# EAGLE design RelayWingTesterRevB (EAGLE 9.2.2)
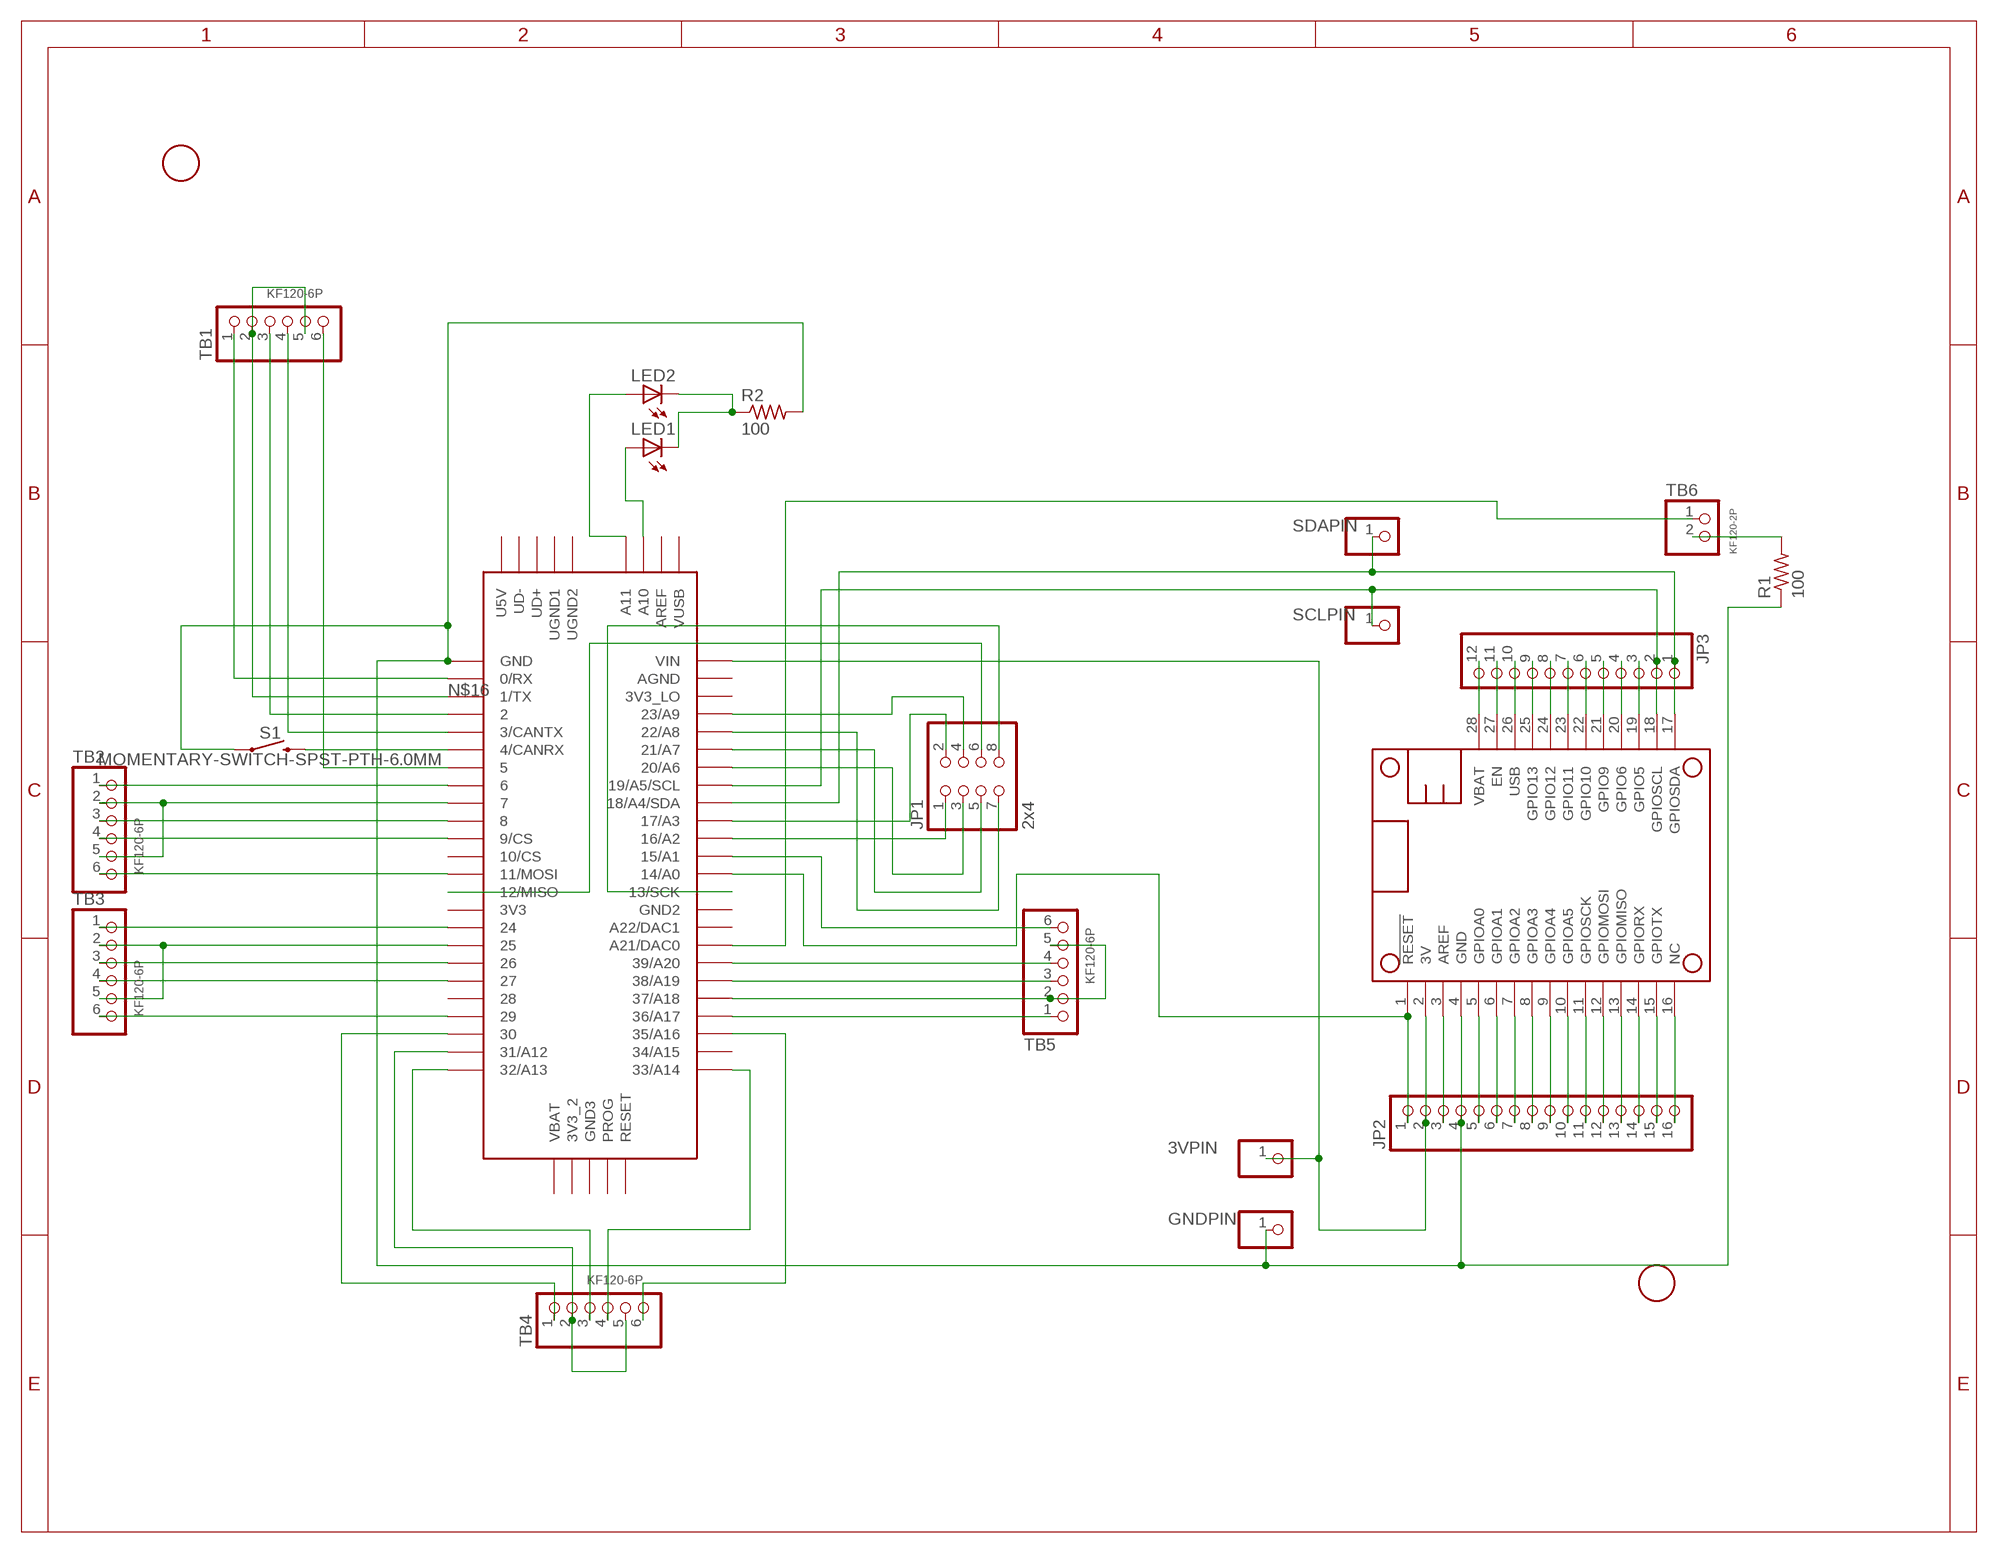
[diagram p0: schematic, sheet 1]

## Parts
3VPIN  PINHD-1X1  [1X01]
GNDPIN  PINHD-1X1  [1X01]
JP1  2x4  PINHD-2X4  [2X04]
JP2  PINHD-1X16  [1X16]
JP3  PINHD-1X12  [1X12]
LED1  LED5MM  [LED5MM]
LED2  LED5MM  [LED5MM]
MS1  FEATHERWING_NODIM  [FEATHERWING_DIM]
R1  100  R-US_0207/10  [0207/10]
R2  100  R-US_0207/10  [0207/10]
S1  MOMENTARY-SWITCH-SPST-PTH-6.0MM  [TACTILE_SWITCH_PTH_6.0MM]
SCLPIN  PINHD-1X1  [1X01]
SDAPIN  PINHD-1X1  [1X01]
TB1  KF120-6P  [KF120-6P_ROUND]
TB2  KF120-6P  [KF120-6P_ROUND]
TB3  KF120-6P  [KF120-6P_ROUND]
TB4  KF120-6P  [KF120-6P_ROUND]
TB5  KF120-6P  [KF120-6P_ROUND]
TB6  KF120-2P  [KF120-2P_ROUND]
U$2  FIDUCIAL  [FIDUCIAL_1MM]
U$3  FIDUCIAL  [FIDUCIAL_1MM]
U$4  TEENSY_3.5/3.6  [TEENSY_3.5/3.6]

## Nets
3V: 3VPIN.1 JP2.2 MS1.2(3V) U$4.VIN
GND: GNDPIN.1 JP2.4 MS1.4(GND) R1.1 R2.2 S1.1 U$4.GND
N$1: JP2.3 MS1.3(AREF)
N$2: JP3.1 MS1.17(GPIOSDA) SDAPIN.1 U$4.18/A4/SDA
N$3: JP2.5 MS1.5(GPIOA0)
N$4: JP2.6 MS1.6(GPIOA1)
N$5: JP2.7 MS1.7(GPIOA2)
N$6: JP2.8 MS1.8(GPIOA3)
N$7: JP2.9 MS1.9(GPIOA4)
N$8: JP2.10 MS1.10(GPIOA5)
N$9: JP2.11 MS1.11(GPIOSCK)
N$10: JP2.12 MS1.12(GPIOMOSI)
N$11: JP2.13 MS1.13(GPIOMISO)
N$12: JP2.14 MS1.14(GPIORX)
N$13: JP2.15 MS1.15(GPIOTX)
N$14: JP2.16 MS1.16(NC)
N$15: JP3.3 MS1.19(GPIO5)
N$16: TB1.1 U$4.0/RX
N$17: TB1.2 TB1.5 U$4.1/TX
N$18: R1.2 TB6.2
N$19: JP3.4 MS1.20(GPIO6)
N$20: JP3.5 MS1.21(GPIO9)
N$21: JP3.6 MS1.22(GPIO10)
N$22: JP3.7 MS1.23(GPIO11)
N$23: JP3.8 MS1.24(GPIO12)
N$24: TB1.3 U$4.2
N$25: TB1.4 U$4.3/CANTX
N$26: S1.3 U$4.4/CANRX
N$27: TB1.6 U$4.5
N$28: TB2.1 U$4.6
N$29: TB2.2 TB2.5 U$4.7
N$30: TB2.3 U$4.8
N$31: TB2.4 U$4.9/CS
N$33: TB2.6 U$4.11/MOSI
N$34: TB3.1 U$4.24
N$35: TB3.2 TB3.5 U$4.25
N$36: TB3.3 U$4.26
N$37: TB3.4 U$4.27
N$39: TB3.6 U$4.29
N$40: TB4.1 U$4.30
N$41: TB4.2 TB4.5 U$4.31/A12
N$42: TB4.3 U$4.32/A13
N$43: TB4.4 U$4.33/A14
N$45: TB4.6 U$4.35/A16
N$46: TB5.1 U$4.36/A17
N$47: TB5.2 TB5.5 U$4.37/A18
N$48: TB5.3 U$4.38/A19
N$49: TB5.4 U$4.39/A20
N$51: JP3.9 MS1.25(GPIO13)
N$52: TB5.6 U$4.15/A1
N$53: TB6.1 U$4.21/DAC0(A21/DAC0)
N$55: JP1.1 U$4.16/A2
N$56: JP1.2 U$4.17/A3
N$57: JP1.3 U$4.20/A6
N$58: JP1.5 U$4.21/A7
N$59: JP1.7 U$4.22/A8
N$60: JP1.4 U$4.23/A9
N$61: JP3.11 MS1.27(EN)
N$62: JP1.6 U$4.12/MISO
N$63: JP1.8 U$4.13/SCK
N$64: LED2.A U$4.A11
N$65: LED1.A U$4.A10
N$66: LED1.K(C) LED2.K(C) R2.1
RESET: JP2.1 MS1.1(!RESET) U$4.14/A0
SCL: JP3.2 MS1.18(GPIOSCL) SCLPIN.1 U$4.19/A5/SCL
USB: JP3.10 MS1.26(USB)
VBAT: JP3.12 MS1.28(VBAT)
Unconnected: U$4.3V3 U$4.3V3_2 U$4.3V3_LO U$4.10/CS U$4.28 U$4.34/A15 U$4.A22/DAC1 U$4.AGND U$4.AREF U$4.GND2 U$4.GND3 U$4.PROG U$4.RESET U$4.U5V U$4.UD+ U$4.UD- U$4.UGND1 U$4.UGND2 U$4.VBAT U$4.VUSB

## Library data of the parts
3VPIN GNDPIN SCLPIN SDAPIN = adafruit:PINHD-1X1: Pin header 1x1 for 0.1" spacing With round pins
JP1 = pinhead:PINHD-2X4: PIN HEADER
JP2 = pinhead:PINHD-1X16: PIN HEADER
JP3 = pinhead:PINHD-1X12: PIN HEADER
LED1 LED2 = adafruit:LED: LED OSRAM: - CHIPLED LG R971, LG N971, LY N971, LG Q971, LY Q971, LO R971, LY R971 LH N974, LH R974 LS Q976, LO Q976, LY Q976 LO Q996 - Hyper CHIPLED LW Q18S LB Q993, LB Q99A, LB R99A - SideLED LS A670, LO A670, LY A670, LG A670, LP A670 LB A673, LV A673, LT A673, LW A673 LH A674 LY A675 LS A676, LA A676, LO A676, LY A676, LW A676 LS A679, LY A679, LG A679 - Hyper Micro SIDELED® LS Y876, LA Y876, LO Y876, LY Y876 LT Y87S - SmartLED LW L88C, LW L88S LB L89C, LB L89S, LG L890 LS L89K, LO L89K, LY L89K LS L896, LA L896, LO L896, LY L896 - TOPLED LS T670, LO T670, LY T670, LG T670, LP T670 LSG T670, LSP T670, LSY T670, LOP T670, LYG T670 LG T671, LOG T671, LSG T671 LB T673, LV T673, LT T673, LW T673 LH T674 LS T676, LA T676, LO T676, LY T676, LB T676, LH T676, LSB T676, LW T676 LB T67C, LV T67C, LT T67C, LS T67K, LO T67K, LY T67K, LW E67C LS E67B, LA E67B, LO E67B, LY E67B, LB E67C, LV E67C, LT E67C LW T67C LS T679, LY T679, LG T679 LS T770, LO T770, LY T770, LG T770, LP T770 LB T773, LV T773, LT T773, LW T773 LH T774 LS E675, LA E675, LY E675, LS T675 LS T776, LA T776, LO T776, LY T776, LB T776 LHGB T686 LT T68C, LB T68C - Hyper Mini TOPLED® LB M676 - Mini TOPLED Santana® LG M470 LS M47K, LO M47K, LY M47K Source: http://www.osram.convergy.de/
MS1 = microbuilder:FEATHERWING
R1 = resistor:R-US_: RESISTOR, American symbol
R2 = adafruit:R-US_: RESISTOR, American symbol
S1 = SparkFun-Switches:MOMENTARY-SWITCH-SPST: Momentary Switch (Pushbutton) - SPST Normally-open (NO) SPST momentary switches (buttons, pushbuttons). Variants PTH-12MM - 12mm square, through-hole Momentary Pushbutton Switch - 12mm Square <https://www.sparkfun.com/products/9190> (COM-09190) PTH-6.0MM, PTH-6.0MM-KIT - 6.0mm square, through-hole Mini Pushbutton Switch <https://www.sparkfun.com/products/97> (COM-00097) KIT package intended for soldering kit's - only one side of pads' copper is exposed. PTH-RIGHT-ANGLE-KIT - Right-angle, through-hole Right Angle Tactile Button <https://www.sparkfun.com/products/10791> - Used on SparkFun BigTime Watch Kit <https://www.sparkfun.com/products/11734> SMD-12MM - 12mm square, surface-mount Tactile Button - SMD (12mm) <https://www.sparkfun.com/products/12993> (COM-12993) Used on SparkFun PicoBoard <https://www.sparkfun.com/products/11888> SMD-4.5MM - 4.5mm Square Trackball Switch Used on SparkFun Blackberry Trackballer Breakout <https://www.sparkfun.com/products/13169> SMD-4.6MMX2.8MM - 4.60mm x 2.80mm, surface mount Used on SparkFun SAMD21 Mini Breakout <https://www.sparkfun.com/products/13664> SMD-5.2MM, SMD-5.2-REDUNDANT - 5.2mm square, surface-mount Mini Pushbutton Switch - SMD <https://www.sparkfun.com/products/8720> (COM-08720) Used on Arduino Pro Mini <https://www.sparkfun.com/products/11114> REDUNDANT package connects both switch circuits together SMD-6.0X3.5MM - 6.0 x 3.5mm, surface mount Momentary Reset Switch SMD <https://www.sparkfun.com/products/8229> (COM-08229) SMD-6.2MM-TALL - 6.2mm square, surface mount Tactile Button - SMD (6mm) <https://www.sparkfun.com/products/12992> Used on SparkFun Digital Sandbox <https://www.sparkfun.com/products/12651> SMD-RIGHT-ANGLE - Right-angle, surface mount Used on SparkFun Block for Intel® Edison - Arduino <https://www.sparkfun.com/products/13036>; PROD_ID: SWCH-08441; SF_SKU: COM-00097
TB1-TB5 = home:KF120-6P: Kaweei KF120-6P 6-pin screw terminalblock, 0.1" spacing. Adafruit
TB6 = home:KF120-2P: Kaweei KF120-2P 2-pin screw terminal block, 0.1" spacing. Through-hole. Adafruit
U$2 U$3 = adafruit:FIDUCIAL: For use by pick and place machines to calibrate the vision/machine, 1mm By microbuilder.eu
U$4 = Teensy356:TEENSY_3.5/3.6

## Net classes
0 default: width 0.203 mm, clearance 0.203 mm
1 2A: width 0.406 mm, clearance 0.203 mm
2 coils 200mA: width 0.203 mm, clearance 0.203 mm

## Board
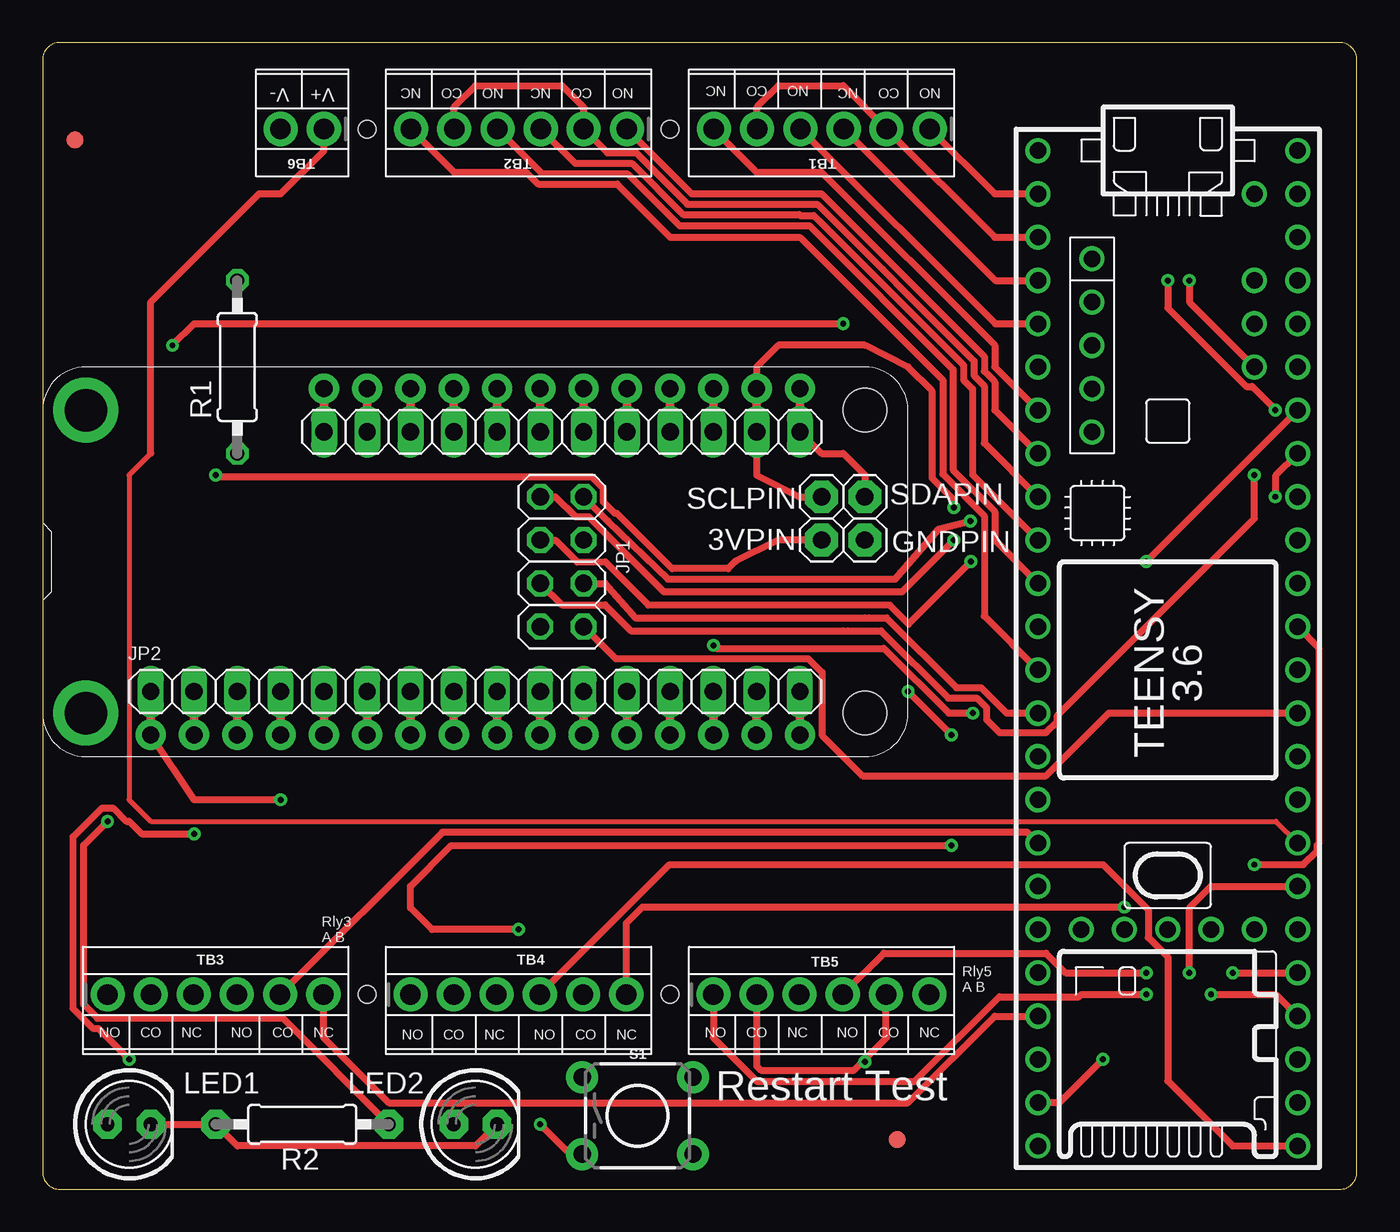
[diagram p1: board, top side]
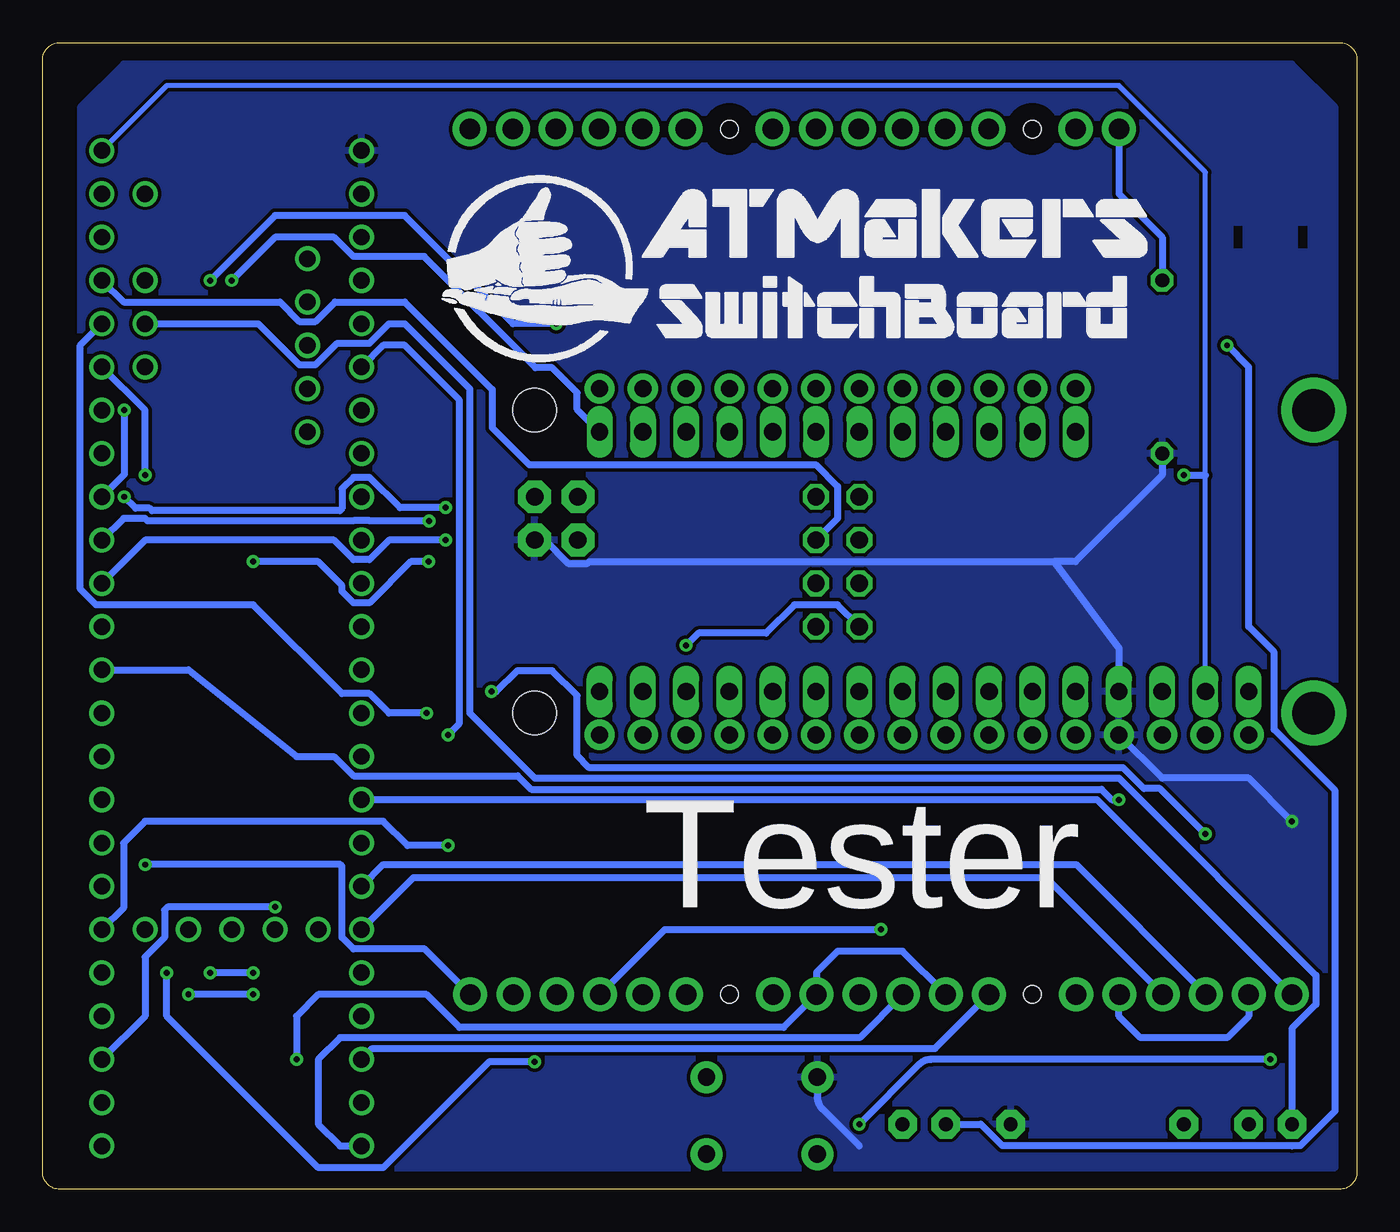
[diagram p2: board, bottom side, seen from below]

Size 77.14 x 67.3 mm. Coordinates in mm from the lower left corner, seen from the top.
Outline: 1,0 76.14,0 arc90 77.14,1 77.14,66.3 arc90 76.14,67.3 1,67.3 arc90 0,66.3 0,1 arc90 1,0
Copper layers (1*16): Top 0.035mm / dielectric 1.5mm / Bottom 0.035mm
Design rules "default *": minimum track width 6mil, minimum drill 0.35mm, track to track 6mil, track to pad 6mil, pad to pad 6mil, via to via 6mil, smd to smd 6mil, copper to edge 40mil, drill to drill 6mil, minimum pad ring 10mil, minimum via ring 8mil, stop-mask expansion 4mil, vias tented up to drill 25mil, thermal gap 10mil
Holes 1.02 mm at 19.05,62.23 36.83,62.23 19.05,11.43 36.83,11.43
bRestrict: area 6.7,55.2 to 7.2,56.5; area 2.9,55.2 to 3.4,56.5
vRestrict: area 4.6,64.8 to 8,66; area 1.3,55.2 to 3.8,56.5; area 5.1,55.2 to 7.6,56.5; area 5.8,58.3 to 7,59.3; area 2,58.4 to 3.3,59.3

### Footprints (pad centres in the part's own frame; a part is rotated, then mirrored left to right if it is on the bottom)
1X01 = drill 1.016 pad 1.93 octagon: 1 0,0
2X04 = drill 1.016 octagon: 1 -3.81,-1.27; 2 -3.81,1.27; 3 -1.27,-1.27; 4 -1.27,1.27; 5 1.27,-1.27; 6 1.27,1.27; 7 3.81,-1.27; 8 3.81,1.27
1X16 = drill 1.016 long: 1 -19.05,0; 2 -16.51,0; 3 -13.97,0; 4 -11.43,0; 5 -8.89,0; 6 -6.35,0; 7 -3.81,0; 8 -1.27,0; 9 1.27,0; 10 3.81,0; 11 6.35,0; 12 8.89,0; 13 11.43,0; 14 13.97,0; 15 16.51,0; 16 19.05,0
1X12 = drill 1.016 long: 1 -13.97,0; 2 -11.43,0; 3 -8.89,0; 4 -6.35,0; 5 -3.81,0; 6 -1.27,0; 7 1.27,0; 8 3.81,0; 9 6.35,0; 10 8.89,0; 11 11.43,0; 12 13.97,0
LED5MM = drill 0.813 pad 1.676 octagon: A -1.27,0; K 1.27,0
FEATHERWING_DIM = drill 1 pad 1.778: 1 6.35,1.27; 2 8.89,1.27; 3 11.43,1.27; 4 13.97,1.27; 5 16.51,1.27; 6 19.05,1.27; 7 21.59,1.27; 8 24.13,1.27; 9 26.67,1.27; 10 29.21,1.27; 11 31.75,1.27; 12 34.29,1.27; 13 36.83,1.27; 14 39.37,1.27; 15 41.91,1.27; 16 44.45,1.27; 17 44.45,21.59; 18 41.91,21.59; 19 39.37,21.59; 20 36.83,21.59; 21 34.29,21.59; 22 31.75,21.59; 23 29.21,21.59; 24 26.67,21.59; 25 24.13,21.59; 26 21.59,21.59; 27 19.05,21.59; 28 16.51,21.59 | drill 2.5 pad 3.81: P$1 2.54,20.32; P$2 2.54,2.54 | hole 2.54: 48.26,20.32; 48.26,2.54
0207/10 = drill 0.813 octagon: 1 -5.08,0; 2 5.08,0
0207/10' = drill 0.813 pad 1.676 octagon: 1 -5.08,0; 2 5.08,0
TACTILE_SWITCH_PTH_6.0MM = drill 1.016 pad 1.88: 1 -3.251,2.261; 2 3.251,2.261; 3 -3.251,-2.261; 4 3.251,-2.261
KF120-6P_ROUND = drill 1.2 pad 2: 1 -6.35,0; 2 -3.81,0; 3 -1.3,0; 4 1.24,0; 5 3.78,0; 6 6.32,0
KF120-2P_ROUND = drill 1.2 pad 2: 1 -1.27,0; 2 1.27,0
FIDUCIAL_1MM = smd 1 x 1: 1 0,0
TEENSY_3.5/3.6 = drill 0.965: 0/RX -25.4,-7.62; 1/TX -22.86,-7.62; 2 -20.32,-7.62; 3/CANTX -17.78,-7.62; 3V3 7.62,-7.62; 3V3_2 17.78,-2.54; 3V3_LO -22.86,7.62; 4/CANRX -15.24,-7.62; 5 -12.7,-7.62; 6 -10.16,-7.62; 7 -7.62,-7.62; 8 -5.08,-7.62; 9/CS -2.54,-7.62; 10/CS 0,-7.62; 11/MOSI 2.54,-7.62; 12/MISO 5.08,-7.62; 13/SCK 5.08,7.62; 14/A0 2.54,7.62; 15/A1 0,7.62; 16/A2 -2.54,7.62; 17/A3 -5.08,7.62; 18/A4/SDA -7.62,7.62; 19/A5/SCL -10.16,7.62; 20/A6 -12.7,7.62; 21/A7 -15.24,7.62; 21/DAC0 12.7,7.62; 22/A8 -17.78,7.62; 23/A9 -20.32,7.62; 24 10.16,-7.62; 25 12.7,-7.62; 26 15.24,-7.62; 27 17.78,-7.62; 28 20.32,-7.62; 29 22.86,-7.62; 30 25.4,-7.62; 31/A12 27.94,-7.62; 32/A13 30.48,-7.62; 33/A14 30.48,7.62; 34/A15 27.94,7.62; 35/A16 25.4,7.62; 36/A17 22.86,7.62; 37/A18 20.32,7.62; 38/A19 17.78,7.62; 39/A20 15.24,7.62; A10 -17.78,5.08; A11 -15.24,5.08; A22/DAC1 10.16,7.62; AGND -25.4,7.62; AREF -20.32,5.08; GND -27.94,-7.62; GND2 7.62,7.62; GND3 17.78,0; PROG 17.78,2.54; RESET 17.78,5.08; U5V -21.59,-4.445; UD+ -16.51,-4.445; UD- -19.05,-4.445; UGND1 -13.97,-4.445; UGND2 -11.43,-4.445; VBAT 17.78,-5.08; VIN -27.94,7.62; VUSB -25.4,5.08

### Placement (x,y rotation side)
3VPIN  45.72,38.1 0 top
GNDPIN  48.26,38.1 0 top
JP1  30.48,36.83 270 top
JP2  25.4,29.21 0 top
JP3  30.48,44.45 180 top
LED1  5.08,3.81 0 top
LED2  25.4,3.81 0 top
MS1  0,25.4 0 top
R1  11.43,48.26 90 top
R2  100  [0207/10']  15.24,3.81 0 top
S1  34.92,4.32 0 top
SCLPIN  45.72,40.64 0 top
SDAPIN  48.26,40.64 0 top
TB1  45.72,62.23 180 top
TB2  27.94,62.23 180 top
TB3  10.16,11.43 0 top
TB4  27.94,11.43 0 top
TB5  45.72,11.43 0 top
TB6  15.24,62.23 180 top
U$2  1.91,61.59 0 top
U$3  50.16,2.92 0 top
U$4  66.04,33.02 270 top

### Tracks (layer width: path | path; a pad name or v marks a point on that pad's centre or on a via)
3V  (via drill 0.35)
  Top 0.406: 3VPIN.1 43.18,38.1 40.64,36.83 40.23,36.42 36.95,36.42 33.71,39.66 33.59,39.66 32.92,40.33 32.92,41.12 32.23,41.81 10.26,41.81 v10.16,41.91
  Top 0.508: JP2.2 MS1.2
  Bottom 0.305: JP2.2 8.89,41.91 8.89,59.69 13.97,64.77 69.85,64.77 U$4.VIN
  Bottom 0.406: v10.16,41.91 8.89,41.91
GND  (via drill 0.35)
  Top 0.406: R2.2 14.11,10.02 3.23,10.02 2.4,10.85 2.4,20.18 v3.81,21.59
  Top 0.508: JP2.4 MS1.4
  Bottom 0.406: v3.81,21.59 6.35,24.13 11.43,24.13 MS1.4 | S1.1 31.67,5.42 arc-45 31.38,4.71 29.21,2.54 | GNDPIN.1 47.66,38.1 46.29,36.73 45.15,36.73 45.05,36.83 17.78,36.83 | 17.78,36.83 13.97,31.75 JP2.4 | R1.1 11.43,41.91 16.51,36.83 17.78,36.83
  pour Bottom: 3.81,66.04 72.39,66.04 74.93,63.5 74.93,3.81 74.93,1.27 1.27,1.27 1.27,63.5
N$1
  Top 0.508: JP2.3 MS1.3
N$2  (via drill 0.35)
  Top 0.406: v66.04,53.34 66.04,51.72 70.65,47.12 70.99,47.12 72.39,45.72 v72.34,45.72 | JP3.1 45.72,43.18 46.99,43.18 48.26,41.91 SDAPIN.1
  Top 0.508: MS1.17 JP3.1
  Bottom 0.406: JP3.1 45.77,45.77 45.77,46.75 47.23,48.21 48.21,48.21 54.74,54.74 58.89,54.74 60.04,55.88 63.5,55.88 v66.04,53.34 | v72.34,45.72 72.34,41.96 U$4.18/A4/SDA
N$3
  Top 0.508: JP2.5 MS1.5
N$4
  Top 0.508: JP2.6 MS1.6
N$5
  Top 0.508: JP2.7 MS1.7
N$6
  Top 0.508: JP2.8 MS1.8
N$7
  Top 0.508: JP2.9 MS1.9
N$8
  Top 0.508: JP2.10 MS1.10
N$9
  Top 0.508: JP2.11 MS1.11
N$10
  Top 0.508: JP2.12 MS1.12
N$11
  Top 0.508: JP2.13 MS1.13
N$12
  Top 0.508: JP2.14 MS1.14
N$13
  Top 0.508: JP2.15 MS1.15
N$14
  Top 0.508: JP2.16 MS1.16
N$15
  Top 0.508: MS1.19 JP3.3
N$16
  Top 0.406: TB1.1 55.88,58.42 U$4.0/RX
N$17
  Top 0.406: U$4.1/TX 55.88,55.88 TB1.2 46.99,64.77 43.18,64.77 41.94,63.53 TB1.5
N$18
  Bottom 0.406: R1.2 11.43,55.88 13.97,58.42 TB6.2
N$19
  Top 0.508: MS1.20 JP3.4
N$20
  Top 0.508: MS1.21 JP3.5
N$21
  Top 0.508: MS1.22 JP3.6
N$22
  Top 0.508: MS1.23 JP3.7
N$23
  Top 0.508: MS1.24 JP3.8
N$24
  Top 0.406: TB1.3 55.91,53.34 U$4.2
N$25
  Top 0.406: TB1.4 55.91,50.8 U$4.3/CANTX
N$26  (via drill 0.35)
  Top 0.406: v5.08,7.62 3.29,9.41 2.98,9.41 1.79,10.6 1.79,20.68 3.48,22.38 4.13,22.38 4.92,21.59 5.08,21.59 5.81,20.86 v8.89,20.86 | v50.8,29.21 v53.34,26.67 | v29.21,3.81 30.67,2.35 arc45 31.38,2.06 S1.3
  Bottom 0.406: v8.89,20.86 11.55,23.52 12.5,23.52 13.72,24.74 45.06,24.74 45.77,25.45 45.77,28.97 47.23,30.43 49.29,30.43 50.51,29.21 v50.8,29.21 | U$4.4/CANRX 57.15,49.53 55.88,49.53 52.7,46.35 52.7,27.3 v53.34,26.67 | v29.21,3.81 25.69,7.33 arc45 24.99,7.62 v5.08,7.62
N$27
  Top 0.406: TB1.6 39.4,62.2 41.91,59.69 45.72,59.69 55.88,49.53 55.88,48.26 U$4.5
N$28
  Top 0.406: TB2.1 38.1,58.42 45.72,58.42 55.27,48.87 55.27,48.01 55.88,47.4 55.88,45.72 U$4.6
N$29
  Top 0.406: U$4.7 55.27,43.79 55.27,47.15 54.66,47.76 54.66,48.62 45.47,57.81 37.85,57.81 34.83,60.82 33.16,60.82 TB2.2 31.75,63.5 30.48,64.77 25.4,64.77 24.16,63.53 TB2.5
N$30
  Top 0.406: TB2.3 31.26,60.21 34.58,60.21 37.59,57.2 44.4,57.2 44.45,57.15 45.27,57.15 54.05,48.37 54.05,47.5 54.59,46.97 54.59,41.93 U$4.8
N$31
  Top 0.406: TB2.4 29.33,59.6 34.33,59.6 37.39,56.54 45.01,56.54 53.44,48.11 53.44,42.22 55.88,39.78 55.88,38.1 U$4.9/CS
N$33
  Top 0.406: TB2.6 24.16,59.69 28.38,59.69 29.07,58.99 33.72,58.99 36.83,55.88 44.45,55.88 52.83,47.5 52.83,41.96 55.27,39.52 55.27,33.63 U$4.11/MOSI
N$34
  Bottom 0.406: TB3.1 15.24,22.86 U$4.24
N$35
  Top 0.406: TB3.5 23.46,20.95 57.78,20.95 U$4.25
  Bottom 0.406: TB3.2 6.35,10.16 7.62,8.89 12.7,8.89 13.97,10.16 13.97,11.4 TB3.5
N$36
  Bottom 0.406: TB3.3 16.48,19.05 57.15,19.05 U$4.26
N$37
  Bottom 0.406: TB3.4 18.26,18.29 55.37,18.29 U$4.27
N$39
  Top 0.406: TB3.6 16.48,8.92 20.32,5.08 50.8,5.08 55.88,10.16 U$4.29
N$40
  Bottom 0.406: TB4.1 24.77,8.26 57.78,8.26 U$4.30
N$41  (via drill 0.35)
  Top 0.406: v62.23,7.62 59.69,5.08 U$4.31/A12
  Bottom 0.406: TB4.2 26.67,13.97 30.48,13.97 31.72,12.73 TB4.5 33.65,9.5 52.68,9.5 54.61,11.43 60.96,11.43 62.23,10.16 v62.23,7.62
N$42
  Bottom 0.406: TB4.3 29.18,8.89 59.69,8.89 60.96,7.62 60.96,3.81 59.69,2.54 U$4.32/A13
N$43
  Top 0.406: U$4.33/A14 69.85,2.54 66.04,6.35 66.04,13.62 64.9,14.77 64.9,16.38 62.23,19.05 36.8,19.05 TB4.4
N$45  (via drill 0.35)
  Top 0.406: TB4.6 34.26,15.62 35.2,16.56 v63.5,16.56
  Bottom 0.406: v63.5,16.56 69.8,16.56 69.98,16.38 69.98,14.77 71.12,13.62 71.12,10.16 U$4.35/A16
N$46  (via drill 0.35)
  Top 0.406: TB5.1 39.37,8.89 41.94,6.33 51.18,6.33 56.16,11.3 60.83,11.3 60.96,11.43 v64.77,11.43 | v68.58,11.43 72.39,11.43 U$4.36/A17
  Bottom 0.406: v64.77,11.43 v68.58,11.43
N$47  (via drill 0.35)
  Top 0.406: TB5.2 41.91,7.24 42.16,6.99 47.62,6.99 48.26,7.62 | 48.26,7.62 49.53,8.89 49.5,8.92 TB5.5 | 48.26,7.62 v48.26,7.47 | v69.85,12.7 U$4.37/A18
  Bottom 0.406: v48.26,7.47 50.95,7.47 57.15,1.27 60.96,1.27 69.85,10.16 v69.85,12.7
N$48  (via drill 0.35)
  Top 0.406: v27.94,15.24 22.86,15.24 21.59,16.51 21.59,17.78 23.98,20.17 v53.34,20.17
  Bottom 0.406: TB5.3 40.61,15.24 v27.94,15.24 | v53.34,20.17 55.73,20.17 57.15,21.59 71.12,21.59 72.39,20.32 72.39,16.51 U$4.38/A19
N$49  (via drill 0.35)
  Top 0.406: v64.77,12.7 60.04,12.7 58.89,13.84 49.37,13.84 TB5.4 | v67.31,12.7 67.31,16.51 68.58,17.78 U$4.39/A20
  Bottom 0.406: v64.77,12.7 v67.31,12.7
N$51
  Top 0.508: MS1.25 JP3.9
N$52  (via drill 0.35)
  Top 0.406: v71.12,19.05 74.01,19.05 74.8,19.85 74.8,20.19 74.93,20.32 74.93,31.75 U$4.15/A1
  Bottom 0.406: v71.12,19.05 59.66,19.05 59.56,18.95 59.56,14.77 58.89,14.1 54.71,14.1 TB5.6
N$53
  Top 0.305: 6.35,43.18 5.08,41.91 5.08,22.86 6.35,21.59 72.39,21.59 U$4.21/DAC0
  Top 0.406: 6.35,43.18 6.35,52.07 12.7,58.42 13.97,58.42 16.51,60.96 TB6.1
N$55  (via drill 0.35)
  Top 0.406: v53.49,38.1 50.45,35.06 36.47,35.06 32.06,39.47 31.27,39.47 30.1,40.64 JP1.1
  Bottom 0.406: v53.49,38.1 56.8,38.1 57.95,36.96 58.89,36.96 60.04,38.1 71.12,38.1 U$4.16/A2
N$56  (via drill 0.35)
  Top 0.406: JP1.2 33.17,39.22 36.7,35.81 50.04,35.81 52.58,38.73 v54.46,39.22
  Bottom 0.406: v54.46,39.22 57.93,39.22 57.95,39.24 58.89,39.24 58.91,39.22 70.97,39.22 71.12,39.37 72.39,39.37 U$4.17/A3
N$57  (via drill 0.35)
  Top 0.406: JP1.3 30.1,38.1 31.39,36.8 33.02,36.83 35.56,34.29 49.74,34.26 50.83,33.17 v54.49,36.83 | v64.77,36.83 U$4.20/A6
  Bottom 0.406: v54.49,36.83 55.53,36.83 57.95,34.42 58.89,34.42 59.56,35.09 59.56,35.43 60.96,36.83 v64.77,36.83
N$58  (via drill 0.35)
  Top 0.406: JP1.5 30.48,34.29 33.02,34.29 34.54,32.77 46.99,32.77 47.24,32.77 49.22,32.77 53.15,28.83 54.83,28.83 55.4,28.27 55.4,27.56 56.16,26.8 58.89,26.8 59.56,27.47 59.56,27.81 71.12,39.37 v71.12,41.91
  Bottom 0.406: v71.12,41.91 71.12,45.72 U$4.21/A7
N$59  (via drill 0.35)
  Top 0.406: v39.37,31.93 39.55,31.75 49.37,31.75 53.18,27.94 v54.61,27.94
  Bottom 0.406: JP1.7 30.48,34.29 33.02,34.29 34.67,32.64 38.66,32.64 v39.37,31.93 | v54.61,27.94 56.8,27.94 57.95,29.08 59.56,29.08 64.77,34.29 74.01,34.29 74.93,35.21 74.93,49.53 U$4.22/A8
N$60
  Bottom 0.406: U$4.23/A9 72.39,52.07 63.21,52.07 62.07,50.93 61.12,50.93 59.98,52.07 55.88,52.07 50.75,46.94 50.75,44.69 48.58,42.52 31.75,42.52 30.48,41.25 30.48,39.37 JP1.4
N$61
  Top 0.508: MS1.27 JP3.11
N$62
  Top 0.406: JP1.6 33.02,35.56 34.8,33.53 48.26,33.53 48.51,33.53 49.53,33.53 53.62,29.44 55.08,29.44 56.58,27.94 U$4.12/MISO
N$63
  Top 0.406: JP1.8 33.63,31.14 44.93,31.14 45.74,30.33 45.74,26.64 48.13,24.26 58.89,24.26 62.58,27.94 U$4.13/SCK
N$64  (via drill 0.35)
  Top 0.406: v7.62,49.53 8.89,50.8 v46.99,50.8 | v67.31,53.34 67.31,52.07 U$4.A11
  Bottom 0.406: LED2.A 22.08,3.81 20.84,2.56 3.83,2.56 3.81,2.54 3.79,2.56 3.29,2.56 1.27,4.59 1.27,23.4 4.85,26.98 4.85,31.52 6.35,33.02 6.35,43.18 6.35,48.26 v7.62,49.53 | v46.99,50.8 49.53,50.8 55.88,57.15 63.5,57.15 v67.31,53.34
N$65
  Bottom 0.406: U$4.A10 64.48,50.8 62.07,48.39 61.12,48.39 59.85,49.66 57.95,49.66 56.8,50.8 55.88,50.8 52.07,46.99 52.07,27.94 48.26,24.13 13.97,24.13 2.4,12.56 2.4,10.85 3.81,9.44 LED1.A
N$66
  Top 0.406: LED1.K R2.1 11.43,2.54 25.4,2.54 LED2.K
RESET  (via drill 0.35)
  Top 0.406: v13.97,22.86 8.89,22.86 MS1.1
  Top 0.508: MS1.1 JP2.1
  Bottom 0.406: U$4.14/A0 68.58,30.48 62.23,25.4 60.04,25.4 58.89,24.26 49.25,24.26 48.46,23.47 14.99,23.47 14.38,22.86 v13.97,22.86
SCL  (via drill 0.35)
  Top 0.406: v72.34,40.64 72.39,40.69 72.39,41.91 U$4.19/A5/SCL | JP3.2 41.91,41.91 44.45,40.64 SCLPIN.1 | v53.49,40.01 53.49,40.44 52.22,41.71 52.22,46.84 50.8,48.26 48.26,49.53 43.18,49.53 41.91,48.26 MS1.18
  Top 0.508: MS1.18 JP3.2
  Bottom 0.406: v53.49,40.01 56.17,40.01 57.95,41.78 58.89,41.78 59.56,41.11 59.56,39.96 59.69,39.83 70.72,39.83 70.87,39.98 71.68,39.98 v72.34,40.64
USB
  Top 0.508: MS1.26 JP3.10
VBAT
  Top 0.508: JP3.12 MS1.28

### Text on the board
tPlace: V- | V+ | NO CO NC | NO CO NC | NO CO NC | NO CO NC | Rly3 / A B | Rly5 / A B | NO CO NC | NO CO NC | NO CO NC | NO CO NC | NO CO NC | NO CO NC
tNames: Restart Test
bNames: Tester